# Altium project plobo_A2t.PrjPCB
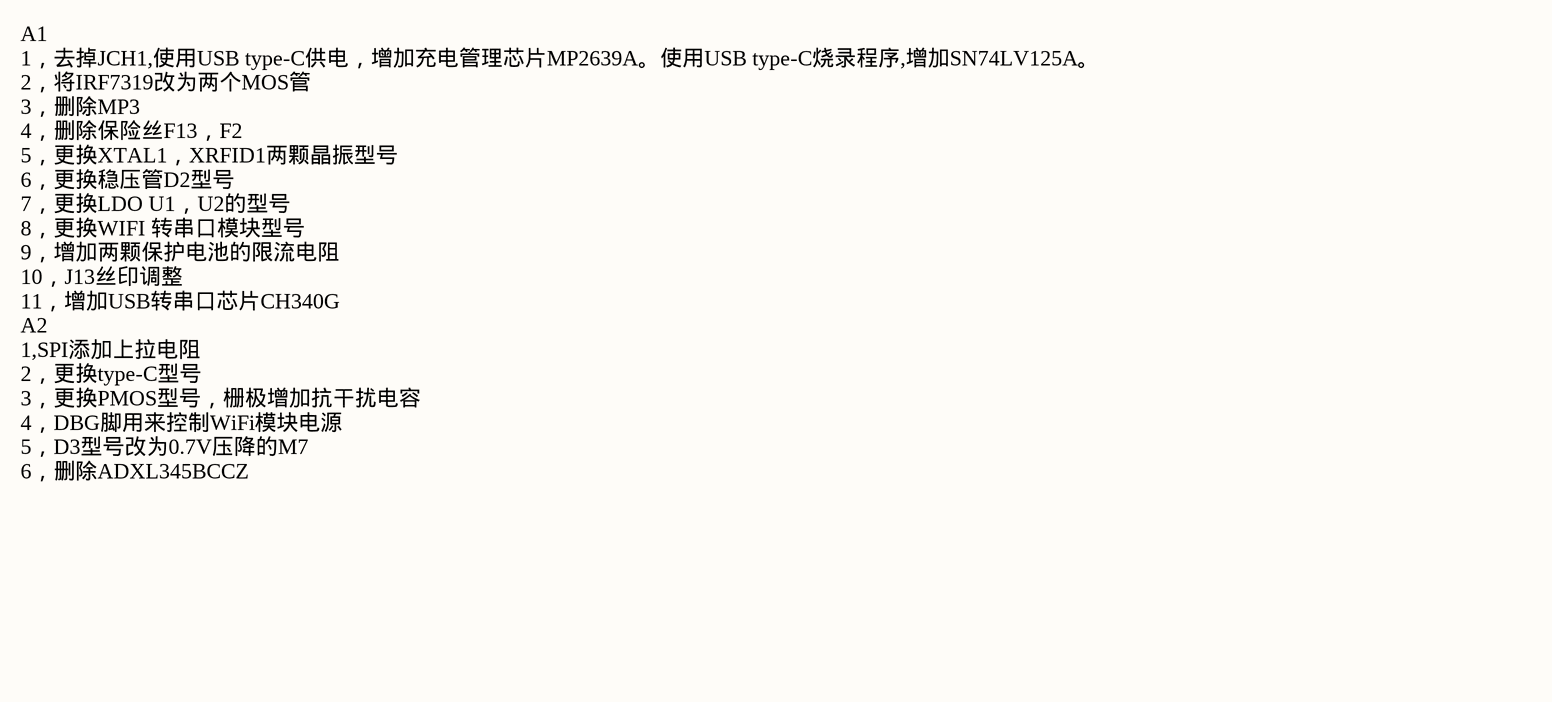
[diagram p0: changelist.SchDoc]
8 sheets, 200 parts. Net scope: global (net labels, ports and power ports of the same name join across sheets).
Board file: plobot_final23.PcbDoc
Sheets:
  changelist.SchDoc
  power.SchDoc
  connections.SchDoc
    U_cpu = cpu.SchDoc
    U_inout = inout.SchDoc
    U_rfid = rfid.SchDoc
    U_motion = motion.SchDoc
    U_audio = audio.SchDoc

## Sheet changelist.SchDoc
size A2

### Notes on the sheet
- A1
  1，去掉JCH1,使用USB type-C供电，增加充电管理芯片MP2639A。使用USB type-C烧录程序,增加SN74LV125A。
  2，将IRF7319改为两个MOS管
  3，删除MP3
  4，删除保险丝F13，F2
  5，更换XTAL1，XRFID1两颗晶振型号
  6，更换稳压管D2型号
  7，更换LDO U1，U2的型号
  8，更换WIFI 转串口模块型号
  9，增加两颗保护电池的限流电阻
  10，J13丝印调整
  11，增加USB转串口芯片CH340G
  A2
  1,SPI添加上拉电阻
  2，更换type-C型号
  3，更换PMOS型号，栅极增加抗干扰电容
  4，DBG脚用来控制WiFi模块电源
  5，D3型号改为0.7V压降的M7
  6，删除ADXL345BCCZ

## Sheet power.SchDoc
size A2
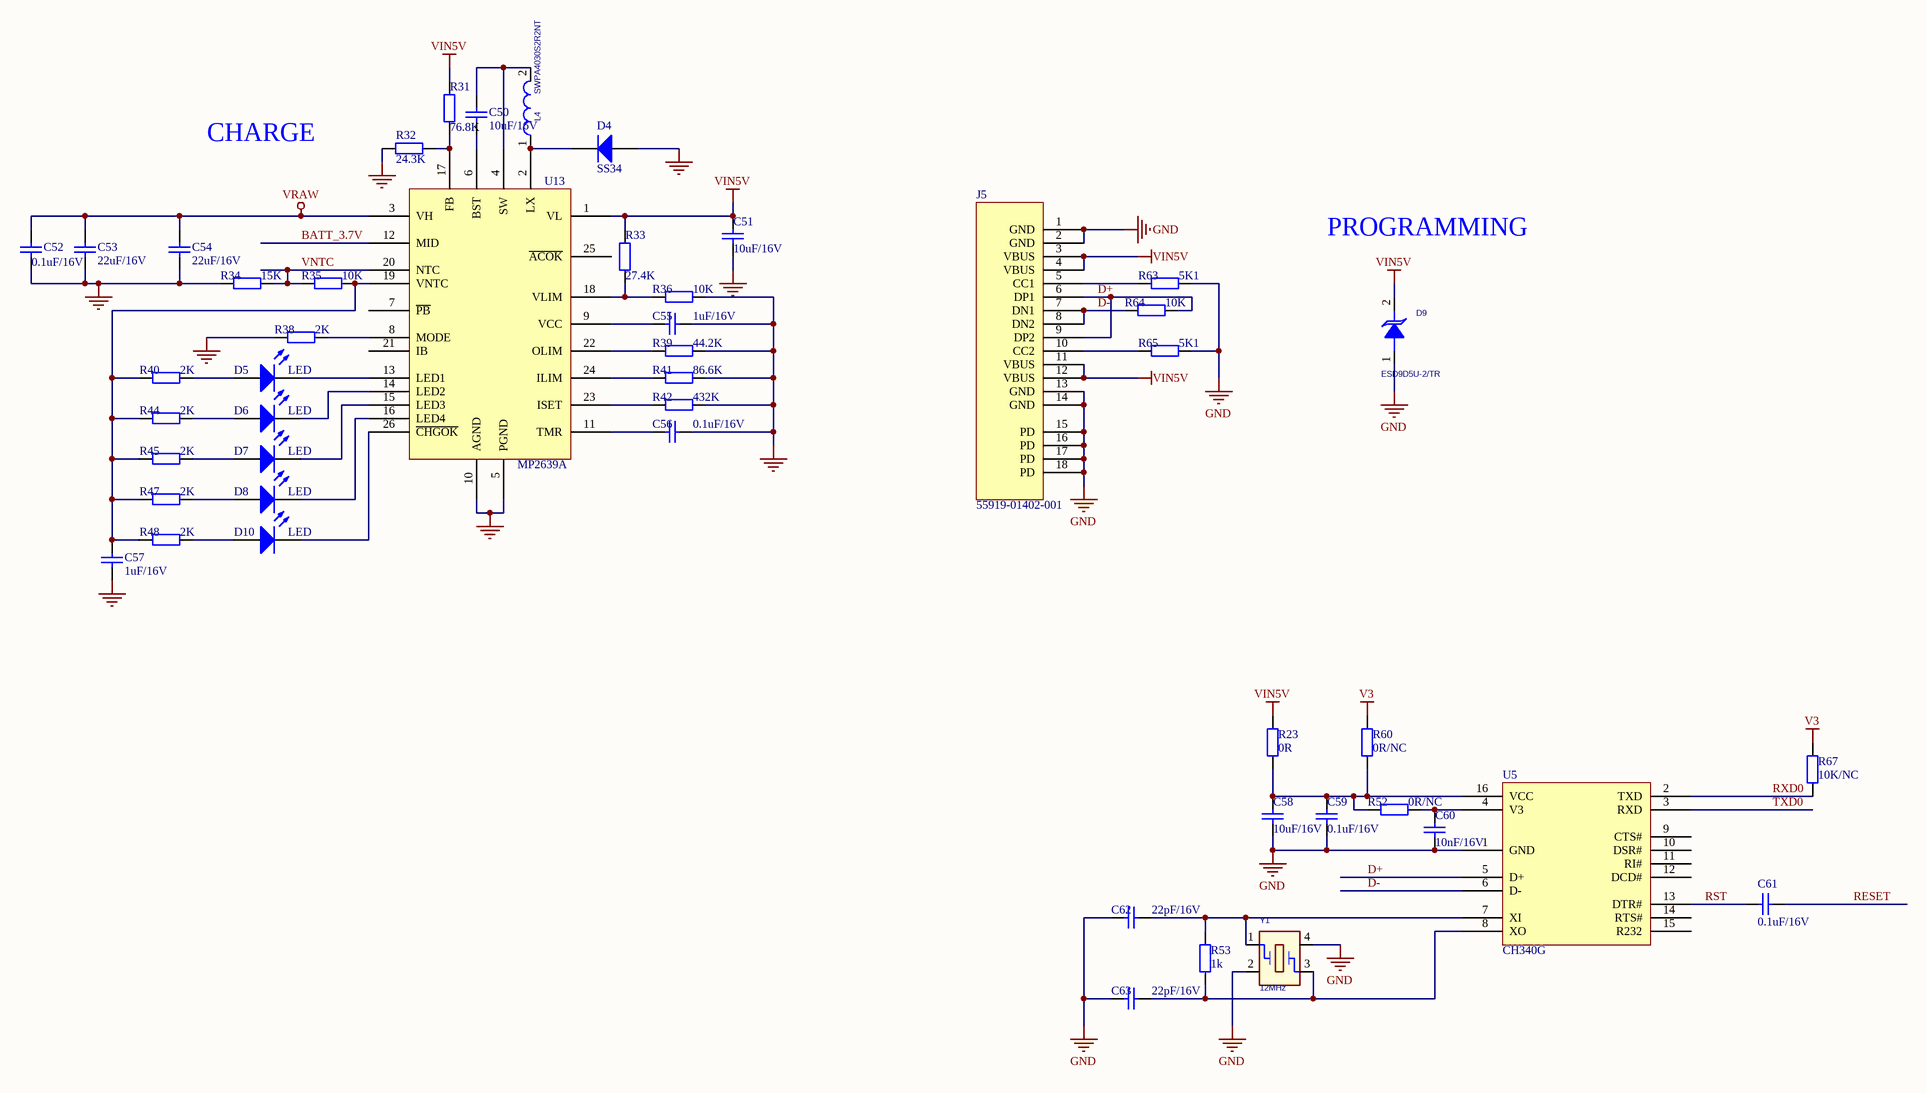
[diagram p1: power.SchDoc]

### Parts
C50  10uF/16V  [CAPC1608N]
C51  10uF/16V  [CAPC1608N]
C52  0.1uF/16V  [CAPC1608N]
C53  22uF/16V  [CAPC2012N]
C54  22uF/16V  [CAPC2012N]
C55  1uF/16V  [CAPC1608N]
C56  0.1uF/16V  [CAPC1608N]
C57  1uF/16V  [CAPC1608N]
C58  10uF/16V  [CAPC1608N]
C59  0.1uF/16V  [CAPC1608N]
C60  10nF/16V  [CAPC1608N]
C61  0.1uF/16V  [CAPC1608N]
C62  22pF/16V  [CAPC1608N]
C63  22pF/16V  [CAPC1608N]
D4  SS34  [SMB]
D5  LED  [0603LED G]
D6  LED  [0603LED G]
D7  LED  [0603LED G]
D8  LED  [0603LED G]
D9  ESD9D5U-2/TR  [sod-923]
D10  LED  [0603LED G]
J5  55919-01402-001  [55919-01402-001]
L4  SWPA4030S2R2NT  [L4X4]
R23  0R  [RESC1608N]
R31  76.8K  [RESC1608N]
R32  24.3K  [RESC1608N]
R33  27.4K  [RESC1608N]
R34  15K  [RESC1608N]
R35  10K  [RESC1608N]
R36  10K  [RESC1608N]
R38  2K  [RESC1608N]
R39  44.2K  [RESC1608N]
R40  2K  [RESC1608N]
R41  86.6K  [RESC1608N]
R42  432K  [RESC1608N]
R44  2K  [RESC1608N]
R45  2K  [RESC1608N]
R47  2K  [RESC1608N]
R48  2K  [RESC1608N]
R52  0R/NC  [RESC1608N]
R53  1k  [RESC1608N]
R60  0R/NC  [RESC1608N]
R63  5K1  [RESC1608N]
R64  10K  [RESC1608N]
R65  5K1  [RESC1608N]
R67  10K/NC  [RESC1608N]
U5  CH340G  [sop16]
U13  MP2639A  [MP2639A]
Y1  12MHz  [XTAL-3225]

### Nets
GND: C51.1 C52.1 C53.1 C54.1 C55.1 C56.1 C57.1 C58.2 C59.2 C60.2 C62.2 C63.2 D4.1(A) D9.1 J5.1(GND) J5.2(GND) J5.13(GND) J5.14(GND) J5.15(PD) J5.16(PD) J5.17(PD) J5.18(PD) R32.1 R34.2 R36.2 R38.2 R39.2 R41.2 R42.2 R63.1 R65.1 U5.1(GND) U13.5(PGND) U13.10(AGND) Y1.2 Y1.4
V3: R60.1 R67.1
VIN5V: C51.2 D9.2 J5.3(VBUS) J5.4(VBUS) J5.11(VBUS) J5.12(VBUS) R23.1 R31.1 R33.1 U13.1(VL)
VRAW: C52.2 C53.2 C54.2 U13.3(VH)
BATT_3.7V: U13.12(MID)
D+: J5.6(DP1) J5.9(DP2) R64.2 U5.5(D+)
D-: J5.7(DN1) J5.8(DN2) R64.1 U5.6(D-)
RESET: C61.2
RST: C61.1 U5.13(DTR#)
RXD0: R67.2 U5.2(TXD)
TXD0: U5.3(RXD)
VNTC: R34.1 R35.2 U13.20(NTC)
NetC50_1: C50.1 U13.6(BST)
NetC50_2: C50.2 L4.2 U13.4(SW)
NetC55_2: C55.2 U13.9(VCC)
NetC56_2: C56.2 U13.11(TMR)
NetC57_2: C57.2 R35.1 R40.2 R44.2 R45.2 R47.2 R48.2 U13.19(VNTC)
NetC58_1: C58.1 C59.1 R23.2 R52.2 R60.2 U5.16(VCC)
NetC60_1: C60.1 R52.1 U5.4(V3)
NetC62_1: C62.1 R53.1 U5.7(XI) Y1.1
NetC63_1: C63.1 R53.2 U5.8(XO) Y1.3
NetD4_2: D4.2(K) L4.1 U13.2(LX)
NetD5_1: D5.1(A) R40.1
NetD5_2: D5.2(K) U13.13(LED1)
NetD6_1: D6.1(A) R44.1
NetD6_2: D6.2(K) U13.14(LED2)
NetD7_1: D7.1(A) R45.1
NetD7_2: D7.2(K) U13.15(LED3)
NetD8_1: D8.1(A) R47.1
NetD8_2: D8.2(K) U13.16(LED4)
NetD10_1: D10.1(A) R48.1
NetD10_2: D10.2(K) U13.26(~{CHGOK})
NetJ5_5: J5.5(CC1) R63.2
NetJ5_10: J5.10(CC2) R65.2
NetR31_2: R31.2 R32.2 U13.17(FB)
NetR33_2: R33.2 R36.1 U13.18(VLIM)
NetR38_1: R38.1 U13.8(MODE)
NetR39_1: R39.1 U13.22(OLIM)
NetR41_1: R41.1 U13.24(ILIM)
NetR42_1: R42.1 U13.23(ISET)

Not connected (* = marked no-connect by the designer): U5 9(CTS#) 10(DSR#) 11(RI#) 12(DCD#) 14(RTS#) 15(R232); U13 7(~{PB}) 21(IB) 25(~{ACOK})

### Notes on the sheet
- CHARGE
- PROGRAMMING

### Library data of the parts
C50-C63 = Cap_2: Capacitor; PackageReference: RAD-0.3; ComponentLink2Description: Datasheet; ComponentLink3Description: DIGIKEY
  C50 C51 C58: Value: 10uF/16V
  C52 C56 C59 C61: Value: 0.1uF/16V
  C53 C54: Value: 22uF/16V
  C55 C57: Value: 1uF/16V
  C60: Value: 10nF/16V
  C62 C63: Value: 22pF/16V
D4 = DIODE: Default Diode; Published: 8-Jun-2000; LatestRevisionDate: 17-Jul-2002; LatestRevisionNote: Re-released for DXP Platform.; Publisher: Altium Limited; Code_JEDEC: DO-214-AB
D5-D8 D10 = LED0: Typical INFRARED GaAs LED; Published: 8-Jun-2000; LatestRevisionDate: 08-Jul-2005; LatestRevisionNote: Mech Layer 1 removed.; PackageReference: LED-0; Publisher: Altium Limited; PackageDescription: LED; 2 Leads
D9 = DIODE_TVS: DIODE TVS ESD PROT ULT LOW CAP 5-5.4V SOD-923; CLASS: IC; AGILE_PN: 480-77934; MFG_NAME01: ON SEMICONDUCTOR; MFG_PN01: ESD9L5.0ST5G; CAD_APPROVED: Yes; ROHS: Yes; HEIGHT: 0.40MM
L4 = IND_2.2uH_2.6A_10%_SMD: Inductor 2.2uH smt 2.6A, 58 milliohm; PartName: 2.2uH10%2.6Asmd; Mfr: TDK; MfrNum: VLCF5020T-2R2N2R6-3; TIIntPartnumber: 1L0025; Vendor: Digikey; Cost100: 1.11; Cost10K: 0.37
R23 R31-R36 R38-R42 R44 R45 R47 R48 R52 R53 R60 R63-R65 R67 = Res2: Resistor; PackageReference: AXIAL-0.4
  R23: Value: 0R; ComponentLink3Description: DIGIKEY
  R31: Value: 76.8K; ComponentLink3Description: DIGIKEY
  R32: Value: 24.3K; ComponentLink3Description: DIGIKEY
  R33: Value: 27.4K; ComponentLink3Description: DIGIKEY
  R34: Value: 15K; ComponentLink3Description: DIGIKEY
  R35 R36 R64: Value: 10K; ComponentLink3Description: DIGIKEY
  R38 R40 R44 R45 R47 R48: Value: 2K; ComponentLink3Description: DIGIKEY
  R39: Value: 44.2K; ComponentLink3Description: DIGIKEY
  R41: Value: 86.6K; ComponentLink3Description: DIGIKEY
  R42: Value: 432K; ComponentLink3Description: DIGIKEY
  R52 R60: Value: 0R/NC; ComponentLink3Description: DIGIKEY
  R53: Published: 8-Jun-2000; LatestRevisionDate: 17-Jul-2002; LatestRevisionNote: Re-released for DXP Platform.; Publisher: Altium Limited; Value: 1k
  R63 R65: Value: 5K1; ComponentLink3Description: DIGIKEY
  R67: Value: 10K/NC; ComponentLink3Description: DIGIKEY
Y1 = XTAL_13Y_A: CLASS: IC

## Sheet connections.SchDoc
size A4; PageSetup: Record=PageOptions|CenterHorizontal=False|CenterVertical=False|PrintScale=1.00|XCorrection=1.00|YCorrection=1.00|PrintKind=1|BorderSize=5000000|LeftOffset=0|BottomOffset=0|Orientation=2|PaperLength=1000|PaperWidth=1000|Scale=100|PaperSource=7|PrintQuality=-4|MediaType=1|DitherType=10|PaperKind=A4|PrintScaleMode=0
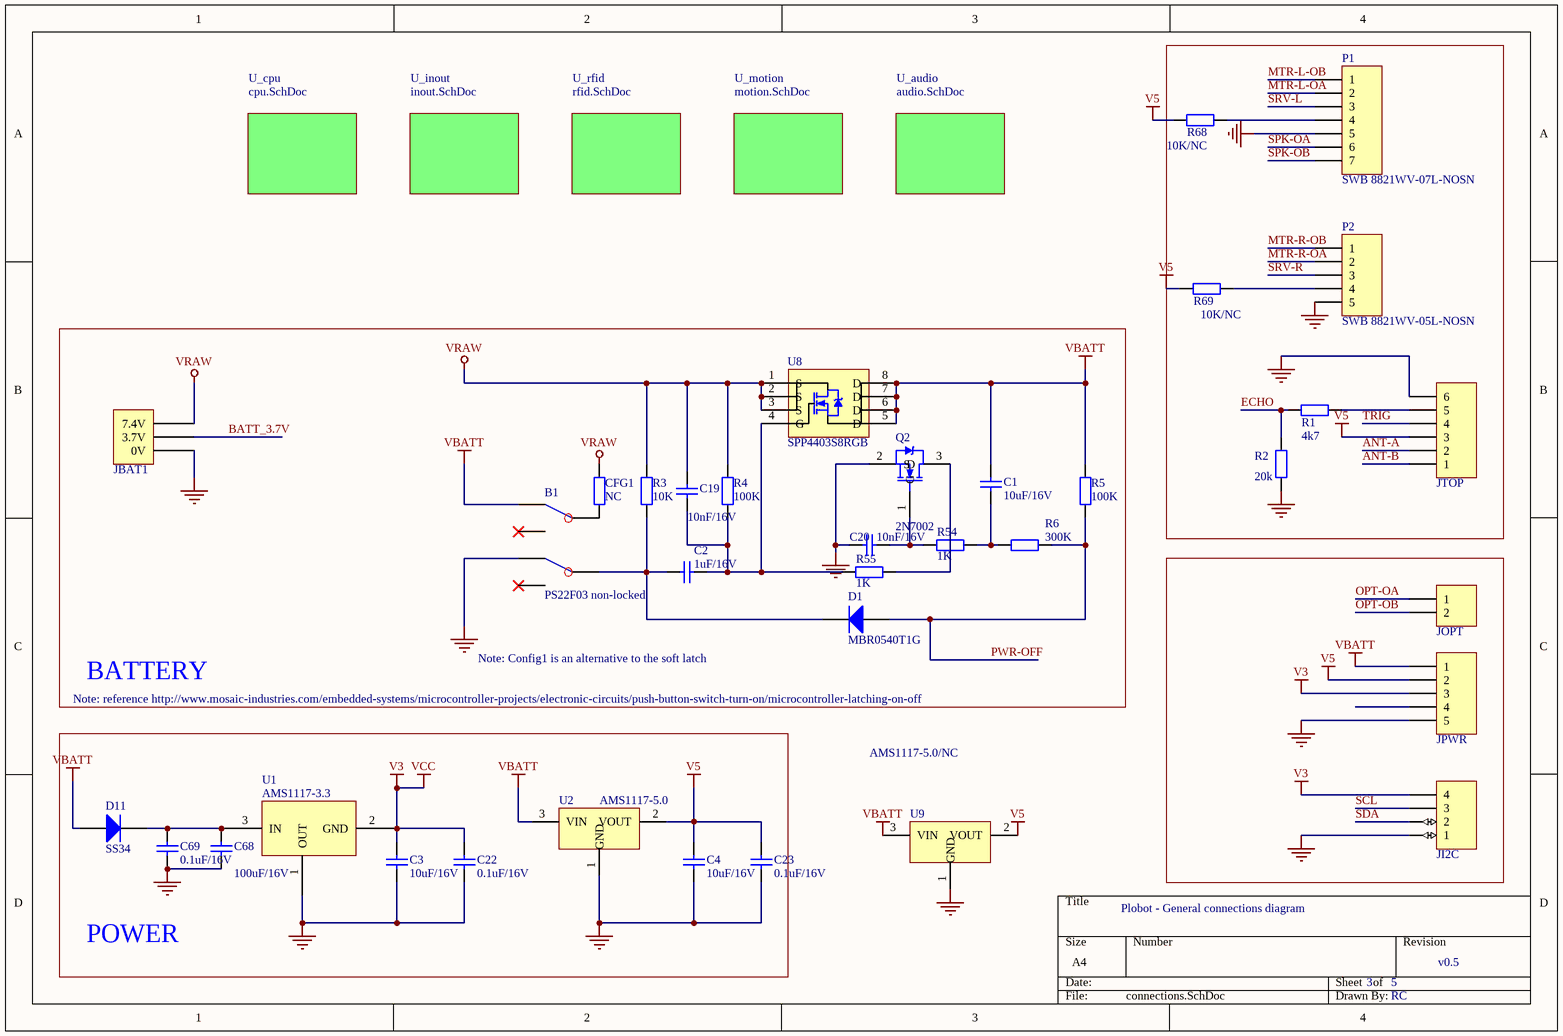
[diagram p2: connections.SchDoc]

### Parts
B1  PS22F03 non-locked  [KGPS22F03]
C1  10uF/16V  [CAPC1608N]
C2  1uF/16V  [CAPC1608N]
C3  10uF/16V  [CAPC1608N]
C4  10uF/16V  [CAPC1608N]
C19  10nF/16V  [CAPC1608N]
C20  10nF/16V  [CAPC1608N]
C22  0.1uF/16V  [CAPC1608N]
C23  0.1uF/16V  [CAPC1608N]
C68  100uF/16V  [Cap6.6X6.6]
C69  0.1uF/16V  [CAPC1608N]
CFG1  NC  [RESC1608N]
D1  MBR0540T1G  [SOD123/X.85]
D11  SS34  [SMB]
JBAT1  Charger  [S3B-XH-A(LF)(SN)]  (value not drawn)
JI2C  Header 4  [HDR1X4]  (value not drawn)
JOPT  Header 2  [HDR1X2]  (value not drawn)
JPWR  Component  [HDR1X5]  (value not drawn)
JTOP  w/lock  [JST-B6B-XH]  (value not drawn)
P1  SWB 8821WV-07L-NOSN  [XH2.54-7]
P2  SWB 8821WV-05L-NOSN  [XH2.54-5]
Q2  2N7002  [SOT23]
R1  4k7  [RESC1608N]
R2  20k  [RESC1608N]
R3  10K  [RESC1608N]
R4  100K  [RESC1608N]
R5  100K  [RESC1608N]
R6  300K  [RESC1608N]
R54  1K  [RESC1608N]
R55  1K  [RESC1608N]
R68  10K/NC  [RESC1608N]
R69  10K/NC  [RESC1608N]
U1  AMS1117-3.3  [SOT223]
U2  AMS1117-5.0  [TO252]
U8  SPP4403S8RGB  [SOP8]
U9  AMS1117-5.0/NC  [SOT-223]

### Blocks framed on the sheet
BATTERY: B1 C1 C2 C19 C20 CFG1 D1 JBAT1 Q2 R3-R6 R54 R55 U8
POWER: C3 C4 C22 C23 C68 C69 D11 U1 U2

### Sub-sheets
U_audio = audio.SchDoc: no entries
U_cpu = cpu.SchDoc: no entries
U_inout = inout.SchDoc: no entries
U_motion = motion.SchDoc: no entries
U_rfid = rfid.SchDoc: no entries

### Nets
GND: B1.4 C3.2 C4.1 C20.1 C22.1 C23.1 C68.1 C69.1 JBAT1.1(0V) JI2C.1 JPWR.5 JTOP.6 P1.5 P2.5 Q2.2(S) R2.2 U1.1(OUT) U2.1(GND) U9.1(GND)
V3: C3.1 C22.2 JI2C.4 JPWR.3 U1.2(GND)  [also labelled VCC]
V5: C4.2 C23.2 JPWR.2 JTOP.3 R68.1 R69.1 U2.2(VOUT) U9.2(VOUT)
VBATT: B1.3 C1.1 D11.1(A) JPWR.1 R5.2 U2.3(VIN) U8.5(D) U8.6(D) U8.7(D) U8.8(D) U9.3(VIN)
VRAW: C19.2 CFG1.1 JBAT1.3(7.4V) R3.2 R4.2 U8.1(S) U8.2(S) U8.3(S)
ANT-A: JTOP.2
ANT-B: JTOP.1
BATT_3.7V: JBAT1.2(3.7V)
ECHO: R1.1 R2.1
MTR-L-OA: P1.2
MTR-L-OB: P1.1
MTR-R-OA: P2.2
MTR-R-OB: P2.1
OPT-OA: JOPT.1
OPT-OB: JOPT.2
PWR-OFF: D1.2(A) R5.1 R6.1
SCL: JI2C.3
SDA: JI2C.2
SPK-OA: P1.6
SPK-OB: P1.7
SRV-L: P1.3
SRV-R: P2.3
TRIG: JTOP.4
NetB1_2: B1.2 CFG1.2
NetB1_5: B1.5 C2.1 D1.1(K) R3.1
NetC1_2: C1.2 R6.2 R54.1
NetC2_2: C2.2 C19.1 R4.1 R55.2 U8.4(G)
NetC20_2: C20.2 Q2.1(G) R54.2
NetC68_2: C68.2 C69.2 D11.2(K) U1.3(IN)
NetJTOP_5: JTOP.5 R1.2
NetP1_4: P1.4 R68.2
NetP2_4: P2.4 R69.2
NetQ2_3: Q2.3(D) R55.1

Not connected (* = marked no-connect by the designer): B1 1* 6*; JPWR 4

### Notes on the sheet
- Note: reference http://www.mosaic-industries.com/embedded-systems/microcontroller-projects/electronic-circuits/push-button-switch-turn-on/microcontroller-latching-on-off
- Note: Config1 is an alternative to the soft latch
- Plobot - General connections diagram
- 3
- 5
- v0.5
- RC

### Library data of the parts
B1 = Component_1
C1-C4 C19 C20 C22 C23 C69 = Cap_2: Capacitor; PackageReference: RAD-0.3
  C1: Value: 10uF/16V; ComponentLink2Description: Datasheet; ComponentLink3Description: DIGIKEY
  C2: Value: 1uF/16V; ComponentLink2Description: Datasheet; ComponentLink3Description: DIGIKEY
  C3: Published: 8-Jun-2000; LatestRevisionDate: 17-Jul-2002; LatestRevisionNote: Re-released for DXP Platform.; Publisher: Altium Limited; Value: 10uF/16V; PackageDescription: Radial Cap, Thru-Hole; 2 Leads; 0.3 in Pin Spacing
  C4: Published: 8-Jun-2000; LatestRevisionDate: 17-Jul-2002; LatestRevisionNote: Re-released for DXP Platform.; Publisher: Altium Limited; PackageDescription: Radial Cap, Thru-Hole; 2 Leads; 0.3 in Pin Spacing; Value: 10uF/16V
  C19 C20: Value: 10nF/16V; ComponentLink2Description: Datasheet; ComponentLink3Description: DIGIKEY
  C22 C23 C69: Value: 0.1uF/16V; ComponentLink2Description: Datasheet; ComponentLink3Description: DIGIKEY
C68 = Cap: Capacitor; Published: 8-Jun-2000; LatestRevisionDate: 17-Jul-2002; LatestRevisionNote: Re-released for DXP Platform.; PackageReference: RAD-0.3; Publisher: Altium Limited; PackageDescription: Radial Cap, Thru-Hole; 2 Leads; 0.3 in Pin Spacing; Value: 100uF/16V
CFG1 R1-R6 R54 R55 R68 R69 = Res2: Resistor; PackageReference: AXIAL-0.4
  CFG1: Value: NC; ComponentLink2Description: Datasheet; ComponentLink3Description: DIGIKEY
  R1: Published: 8-Jun-2000; LatestRevisionDate: 17-Jul-2002; LatestRevisionNote: Re-released for DXP Platform.; Publisher: Altium Limited; Value: 4k7
  R2: Published: 8-Jun-2000; LatestRevisionDate: 17-Jul-2002; LatestRevisionNote: Re-released for DXP Platform.; Publisher: Altium Limited; Value: 20k
  R3: Value: 10K; ComponentLink3Description: DIGIKEY
  R4 R5: Value: 100K; ComponentLink3Description: DIGIKEY
  R6: Value: 300K; ComponentLink3Description: DIGIKEY
  R54 R55: Value: 1K; ComponentLink3Description: DIGIKEY
  R68 R69: Published: 8-Jun-2000; LatestRevisionDate: 17-Jul-2002; LatestRevisionNote: Re-released for DXP Platform.; Publisher: Altium Limited; Value: 10K/NC
D1 = Diode: Default Diode; PackageReference: SMC; ComponentLink3Description: DIGIKEY; ComponentLink3URL: http://www.digikey.com/product-detail/en/fairchild-on-semiconductor/MBR0540/MBR0540TR-ND/1048787
D11 = Diode 1N4007: 1 Amp General Purpose Rectifier; Published: 8-Jun-2000; LatestRevisionDate: 17-Jul-2002; LatestRevisionNote: Re-released for DXP Platform.; DatasheetVersion: 1998; PackageVersion: Aug-1999; PackageReference: DO-41; Publisher: Altium Limited; PackageDescription: Diode, Axial; Body 5.2 x 2.7 mm (LxDia. max), Lead Dia. 0.86 mm (max); Code_JEDEC: DO-204-AL; ComponentLink1Description: Manufacturer Link; ComponentLink1URL: http://www.fairchildsemi.com/; ComponentLink2Description: Datasheet; ComponentLink2URL: http://www.fairchildsemi.com/ds/1N%2F1N4001.pdf
JBAT1 = BATTCON: ComponentLink3Description: TAOBAO; ComponentLink3URL: https://item.taobao.com/item.htm?spm=a1z09.2.0.0.HEqzjA&id=524112080121&_u=goqqgqg0b2c
JI2C = Header 4: Header, 4-Pin; ComponentLink3Description: DIGIKEY
JOPT = Header 2: Header, 2-Pin; LatestRevisionDate: 17-Jul-2002; LatestRevisionNote: Re-released for DXP Platform.; Publisher: Altium Limited
JPWR P2 = Header 5: Header, 5-Pin; LatestRevisionDate: 17-Jul-2002; LatestRevisionNote: Re-released for DXP Platform.; Publisher: Altium Limited
JTOP = Header 6: Header, 6-Pin; ComponentLink2Description: http://www.digikey.com/products/en?keywords=B6B-XH-A(LF)(SN); ComponentLink3Description: DIGIKEY
P1 = Header 7: Header, 7-Pin; LatestRevisionDate: 17-Jul-2002; LatestRevisionNote: Re-released for DXP Platform.; Publisher: Altium Limited
Q2 = 2N7002: NMOS
U1 = LM1117
U2 U9 = LM1117-3.3V

## Sheet cpu.SchDoc
size A4
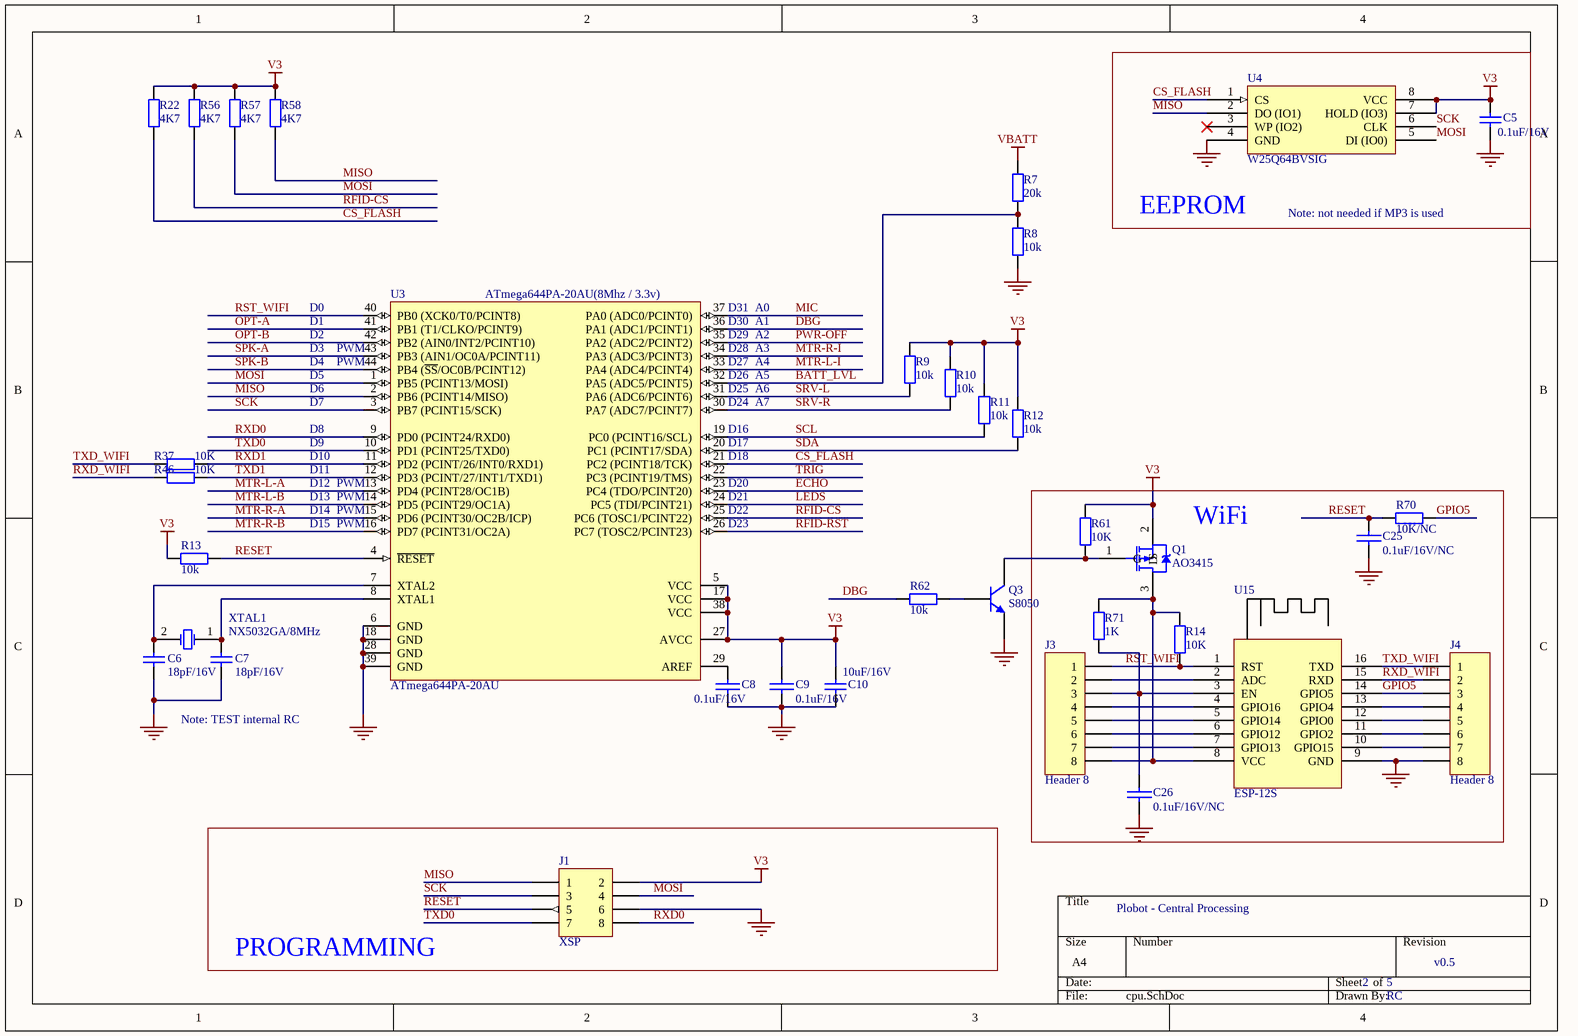
[diagram p3: cpu.SchDoc]

### Parts
C5  0.1uF/16V  [CAPC1608N]
C6  18pF/16V  [CAPC1608N]
C7  18pF/16V  [CAPC1608N]
C8  0.1uF/16V  [CAPC1608N]
C9  0.1uF/16V  [CAPC1608N]
C10  10uF/16V  [CAPC1608N]
C25  0.1uF/16V/NC  [CAPC1608N]
C26  0.1uF/16V/NC  [CAPC1608N]
J1  XSP  [HDR2X4]
J3  Header 8  [HDR1X8]
J4  Header 8  [HDR1X8]
Q1  AO3415  [SOT23]
Q3  S8050  [sot23]
R7  20k  [RESC1608N]
R8  10k  [RESC1608N]
R9  10k  [RESC1608N]
R10  10k  [RESC1608N]
R11  10k  [RESC1608N]
R12  10k  [RESC1608N]
R13  10k  [RESC1608N]
R14  10K  [RESC1608N]
R22  4K7  [RESC1608N]
R37  10K  [RESC1608N]
R46  10K  [RESC1608N]
R56  4K7  [RESC1608N]
R57  4K7  [RESC1608N]
R58  4K7  [RESC1608N]
R61  10K  [RESC1608N]
R62  10k  [RESC1608N]
R70  10K/NC  [RESC1608N]
R71  1K  [RESC1608N]
U3  ATmega644PA-20AU  [atmega644p]
U4  W25Q64BVSIG  [W25Q64BVSIG]
U15  ESP-12S  [ESP-12S]
XTAL1  NX5032GA/8MHz  [XTAL]

### Blocks framed on the sheet
EEPROM: C5 U4
WiFi: C25 C26 J3 J4 Q1 R14 R61 R70 R71 U15
PROGRAMMING: J1

### Nets
GND: C5.2 C6.1 C7.1 C8.2 C9.2 C10.1 C25.2 C26.2 J1.6 J4.8 Q3.1(E) R8.1 U3.6(GND) U3.18(GND) U3.28(GND) U3.39(GND) U4.4(GND) U15.9(GND)
V3: C5.1 C9.1 C10.2 J1.2 Q1.2(S) R9.1 R10.1 R11.2 R12.1 R13.1 R22.1 R56.1 R57.1 R58.1 R61.1 U3.5(VCC) U3.17(VCC) U3.27(AVCC) U3.38(VCC) U4.7(HOLD_(IO3)) U4.8(VCC)
VBATT: R7.2
BATT_LVL: R7.1 R8.2 U3.32(PA5_(ADC5/PCINT5))
CS_FLASH: R22.2 U3.21(PC2_(PCINT18/TCK)) U4.1(CS)
DBG: R62.1 U3.36(PA1_(ADC1/PCINT1))
ECHO: U3.23(PC4_(TDO/PCINT20))
GPIO5: J4.3 R70.2 U15.14(GPIO5)
LEDS: U3.24(PC5_(TDI/PCINT21))
MIC: U3.37(PA0_(ADC0/PCINT0))
MISO: J1.1 R58.2 U3.2(PB6_(PCINT14/MISO)) U4.2(DO_(IO1))
MOSI: J1.4 R57.2 U3.1(PB5_(PCINT13/MOSI)) U4.5(DI_(IO0))
MTR-L-A: U3.13(PD4_(PCINT28/OC1B))
MTR-L-B: U3.14(PD5_(PCINT29/OC1A))
MTR-L-I: U3.33(PA4_(ADC4/PCINT4))
MTR-R-A: U3.15(PD6_(PCINT30/OC2B/ICP))
MTR-R-B: U3.16(PD7_(PCINT31/OC2A))
MTR-R-I: U3.34(PA3_(ADC3/PCINT3))
OPT-A: U3.41(PB1_(T1/CLKO/PCINT9))
OPT-B: U3.42(PB2_(AIN0/INT2/PCINT10))
PWR-OFF: U3.35(PA2_(ADC2/PCINT2))
RESET: C25.1 J1.5 R13.2 R70.1 U3.4(~{RESET})
RFID-CS: R56.2 U3.25(PC6_(TOSC1/PCINT22))
RFID-RST: U3.26(PC7_(TOSC2/PCINT23))
RST_WIFI: J3.1 R14.1 U3.40(PB0_(XCK0/T0/PCINT8)) U15.1(RST)
RXD0: J1.8 U3.9(PD0_(PCINT24/RXD0))
RXD1: R37.2 U3.11(PD2_(PCINT/26/INT0/RXD1))
RXD_WIFI: J4.2 R46.1 U15.15(RXD)
SCK: J1.3 U3.3(PB7_(PCINT15/SCK)) U4.6(CLK)
SCL: R11.1 U3.19(PC0_(PCINT16/SCL))
SDA: R12.2 U3.20(PC1_(PCINT17/SDA))
SPK-A: U3.43(PB3_(AIN1/OC0A/PCINT11))
SPK-B: U3.44(PB4_(~{SS}/OC0B/PCINT12))
SRV-L: R9.2 U3.31(PA6_(ADC6/PCINT6))
SRV-R: R10.2 U3.30(PA7_(ADC7/PCINT7))
TRIG: U3.22(PC3_(PCINT19/TMS))
TXD0: J1.7 U3.10(PD1_(PCINT25/TXD0))
TXD1: R46.2 U3.12(PD3_(PCINT/27/INT1/TXD1))
TXD_WIFI: J4.1 R37.1 U15.16(TXD)
NetC6_2: C6.2 U3.7(XTAL2) XTAL1.2(OSC2)
NetC7_2: C7.2 U3.8(XTAL1) XTAL1.1(OSC1)
NetC8_1: C8.1 U3.29(AREF)
NetC26_1: C26.1 J3.3 R71.1 U15.3(EN)
NetJ3_2: J3.2 U15.2(ADC)
NetJ3_4: J3.4 U15.4(GPIO16)
NetJ3_5: J3.5 U15.5(GPIO14)
NetJ3_6: J3.6 U15.6(GPIO12)
NetJ3_7: J3.7 U15.7(GPIO13)
NetJ3_8: J3.8 Q1.3(D) R14.2 R71.2 U15.8(VCC)
NetJ4_4: J4.4 U15.13(GPIO4)
NetJ4_5: J4.5 U15.12(GPIO0)
NetJ4_6: J4.6 U15.11(GPIO2)
NetJ4_7: J4.7 U15.10(GPIO15)
NetQ1_1: Q1.1(G) Q3.3(C) R61.2
NetQ3_2: Q3.2(B) R62.2

Not connected (* = marked no-connect by the designer): U4 3(WP_(IO2))*

### Notes on the sheet
- Note: not needed if MP3 is used
- D0
- (near U3) ATmega644PA-20AU(8Mhz / 3.3v)
- (near U3) D31
- A0
- D1
- D2
- D3
- D4
- D5
- (near U3) PWM
- (near U3) D26
- (near U3) D27
- (near U3) D28
- (near U3) D29
- (near U3) D30
- A1
- A2
- A3
- A4
- A5
- D6
- D7
- D8
- D9
- (near U3) D16
- (near U3) D17
- (near U3) D24
- (near U3) D25
- A6
- A7
- D10
- D11
- D12
- D13
- D14
- (near U3) D18
- (near U3) D20
- (near U3) D21
- (near U3) D22
- D15
- (near U3) D23
- Note: TEST internal RC
- Plobot - Central Processing
- 2
- 5
- v0.5
- RC

### Library data of the parts
C5-C9 C25 C26 = Cap: Capacitor
  C5: Published: 8-Jun-2000; LatestRevisionDate: 17-Jul-2002; LatestRevisionNote: Re-released for DXP Platform.; PackageReference: RAD-0.3; Publisher: Altium Limited; PackageDescription: Radial Cap, Thru-Hole; 2 Leads; 0.3 in Pin Spacing; Value: 0.1uF/16V
  C6 C7: Published: 8-Jun-2000; LatestRevisionDate: 17-Jul-2002; LatestRevisionNote: Re-released for DXP Platform.; PackageReference: RAD-0.3; Publisher: Altium Limited; Value: 18pF/16V
C10 = Cap_2: Capacitor; Published: 8-Jun-2000; LatestRevisionDate: 17-Jul-2002; LatestRevisionNote: Re-released for DXP Platform.; PackageReference: RAD-0.3; Publisher: Altium Limited; PackageDescription: Radial Cap, Thru-Hole; 2 Leads; 0.3 in Pin Spacing; Value: 10uF/16V
J1 = Header 4X2H: Header, 4-Pin, Dual row, Right Angle; LatestRevisionDate: 17-Jul-2002; LatestRevisionNote: Re-released for DXP Platform.; Publisher: Altium Limited
J3 J4 = Header 8: Header, 8-Pin; LatestRevisionDate: 17-Jul-2002; LatestRevisionNote: Re-released for DXP Platform.; Publisher: Altium Limited
Q1 = AO3415: PMOS
Q3 = 2N3904: NPN General Purpose Amplifier; Published: 8-Jun-2000; LatestRevisionDate: 15-Jan-2003; LatestRevisionNote: PCB Footprint 'BCY-W3/D4.7' replaced; DatasheetVersion: 1997; PackageVersion: Sep-1998; PackageReference: TO-92A; Publisher: Altium Limited; PackageDescription: TO, Flat Index; 3 In-Line, Axial Leads; Body Dia. 4.5mm; Leads 0.51 x 0.48 mm (max); ComponentLink1Description: Manufacturer Link; ComponentLink1URL: http://www.fairchildsemi.com/; ComponentLink2Description: Datasheet; ComponentLink2URL: http://www.fairchildsemi.com/ds/2N%2F2N3904.pdf
R7-R14 R22 R37 R46 R56-R58 R61 R62 R70 R71 = Res2: Resistor; Published: 8-Jun-2000; LatestRevisionDate: 17-Jul-2002; LatestRevisionNote: Re-released for DXP Platform.; PackageReference: AXIAL-0.4; Publisher: Altium Limited
  R7: Value: 20k
  R8-R13 R62: Value: 10k
  R14 R37 R46 R61: Value: 10K
  R22 R56-R58: Value: 4K7
  R70: Value: 10K/NC
  R71: Value: 1K
U3 = ATmega644-20AU: 8-bit AVR Microcontroller, 2.7-5.5V, 20MHz, 64KB Flash, 2KB EEPROM, 4KB SRAM, 44-pin TQFP; DatasheetVersion: revN, Jul-2010; PackageVersion: revC, Oct-2010; PackageReference: 44A; PackageDescription: 44-Pin Plastic Thin Profile Quad Flat Pack, 10 x 10 x 1.0 mm Body, 0.8 mm Pitch (TQFP); Code_JEDEC: MS-026-ACB; ComponentLink1Description: Manufacturer URL; ComponentLink1URL: http://www.atmel.com/; ComponentLink2Description: ATmega644 Datasheet; ComponentLink2URL: http://www.atmel.com/dyn/resources/prod_documents/doc2593.pdf; ComponentLink3Description: ATmega644 Summary; ComponentLink3URL: http://www.atmel.com/dyn/resources/prod_documents/2593S.pdf
XTAL1 = ABM7-8.000MHZ-D2Y-T

## Sheet inout.SchDoc
size A4
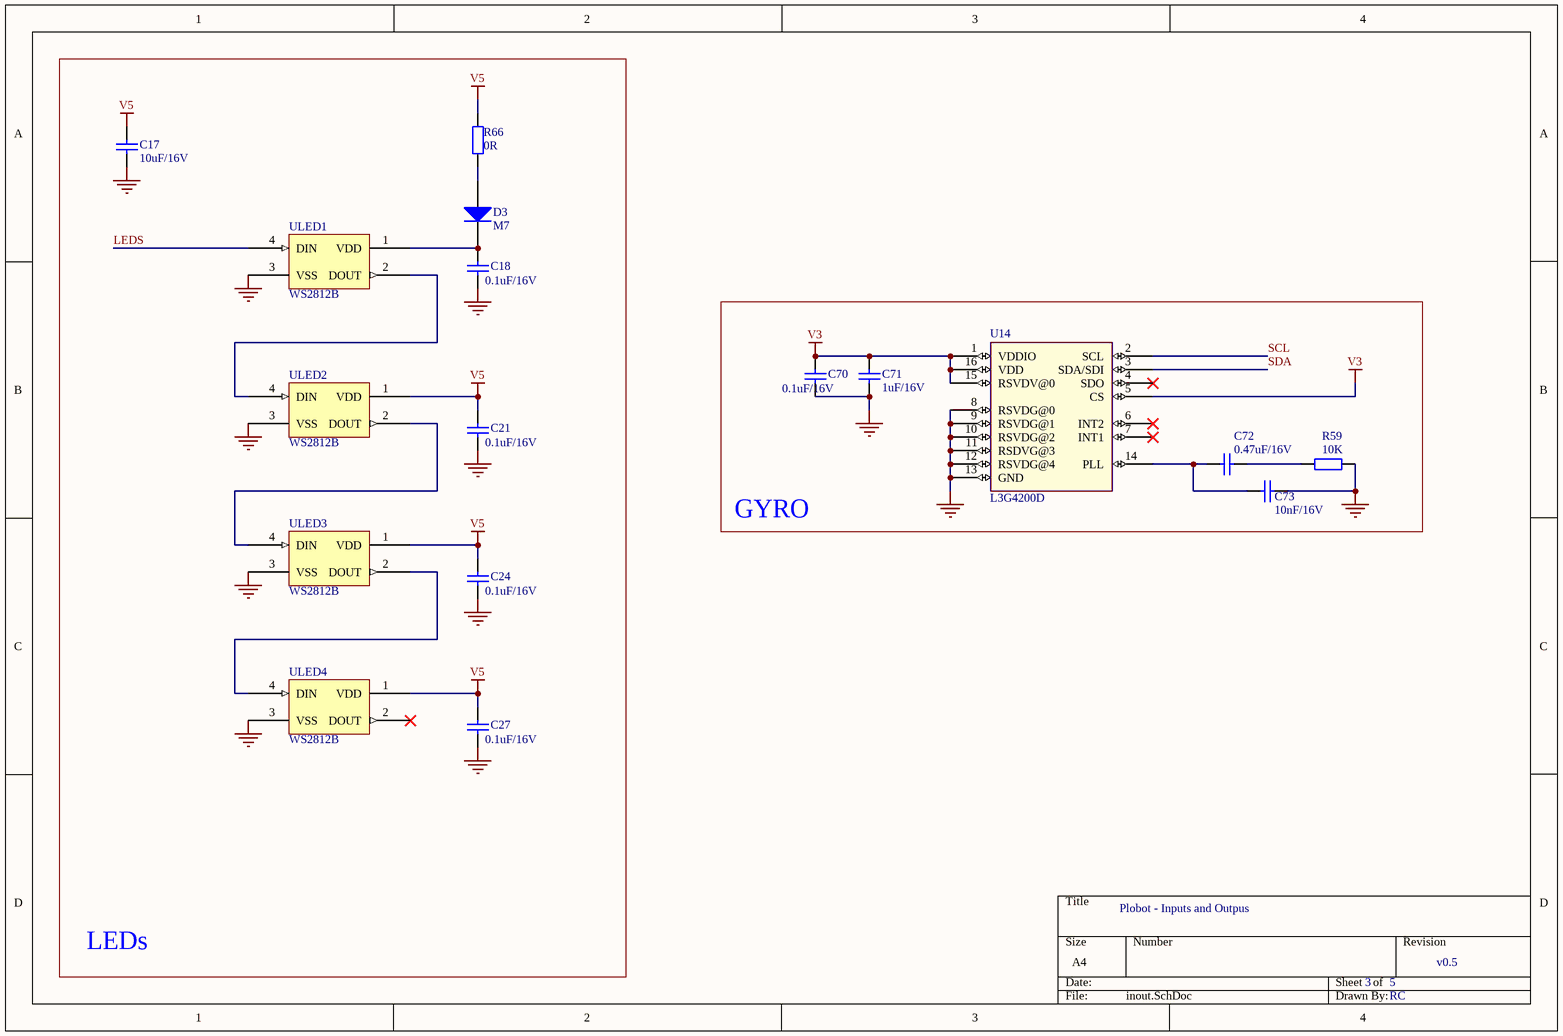
[diagram p4: inout.SchDoc]

### Parts
C17  10uF/16V  [CAPC1608N]
C18  0.1uF/16V  [CAPC1608N]
C21  0.1uF/16V  [CAPC1608N]
C24  0.1uF/16V  [CAPC1608N]
C27  0.1uF/16V  [CAPC1608N]
C70  0.1uF/16V  [CAPC1608N]
C71  1uF/16V  [CAPC1608N]
C72  0.47uF/16V  [CAPC1608N]
C73  10nF/16V  [CAPC1608N]
D3  M7  [SMA]
R59  10K  [RESC1608N]
R66  0R  [RESC1608N]
U14  L3G4200D  [LGA16-4X4]
ULED1  WS2812B  [WS2812B]
ULED2  WS2812B  [WS2812B]
ULED3  WS2812B  [WS2812B]
ULED4  WS2812B  [WS2812B]

### Blocks framed on the sheet
LEDs: C17 C18 C21 C24 C27 D3 R66 ULED1-ULED4
GYRO: C70-C73 R59 U14

### Nets
GND: C17.2 C18.2 C21.2 C24.2 C27.2 C70.2 C71.2 C73.2 R59.2 U14.8(RSVDG@0) U14.9(RSVDG@1) U14.10(RSVDG@2) U14.11(RSDVG@3) U14.12(RSVDG@4) U14.13(GND) ULED1.3(VSS) ULED2.3(VSS) ULED3.3(VSS) ULED4.3(VSS)
V3: C70.1 C71.1 U14.1(VDDIO) U14.5(CS) U14.15(RSVDV@0) U14.16(VDD)
V5: C17.1 C21.1 C24.1 C27.1 R66.2 ULED2.1(VDD) ULED3.1(VDD) ULED4.1(VDD)
LEDS: ULED1.4(DIN)
SCL: U14.2(SCL)
SDA: U14.3(SDA/SDI)
NetC18_1: C18.1 D3.2(K) ULED1.1(VDD)
NetC72_1: C72.1 C73.1 U14.14(PLL)
NetC72_2: C72.2 R59.1
NetD3_1: D3.1(A) R66.1
NetULED1_2: ULED1.2(DOUT) ULED2.4(DIN)
NetULED2_2: ULED2.2(DOUT) ULED3.4(DIN)
NetULED3_2: ULED3.2(DOUT) ULED4.4(DIN)

Not connected (* = marked no-connect by the designer): U14 4(SDO)* 6(INT2)* 7(INT1)*; ULED4 2(DOUT)*

### Notes on the sheet
- Plobot - Inputs and Outpus
- 3
- 5
- v0.5
- RC

### Library data of the parts
C17 C71-C73 = Cap_2: Capacitor; PackageReference: RAD-0.3
  C17: Published: 8-Jun-2000; LatestRevisionDate: 17-Jul-2002; LatestRevisionNote: Re-released for DXP Platform.; Publisher: Altium Limited; PackageDescription: Radial Cap, Thru-Hole; 2 Leads; 0.3 in Pin Spacing; Value: 10uF/16V
  C71: Value: 1uF/16V; ComponentLink3Description: DIGIKEY
  C72: Value: 0.47uF/16V; ComponentLink3Description: DIGIKEY
  C73: Value: 10nF/16V; ComponentLink3Description: DIGIKEY
C18 C21 C24 C27 C70 = Cap: Capacitor; PackageReference: RAD-0.3; Value: 0.1uF/16V
  C18 C21 C24 C27: Published: 8-Jun-2000; LatestRevisionDate: 17-Jul-2002; LatestRevisionNote: Re-released for DXP Platform.; Publisher: Altium Limited; PackageDescription: Radial Cap, Thru-Hole; 2 Leads; 0.3 in Pin Spacing
  C70: ComponentLink3Description: DIGIKEY
D3 = Diode: Default Diode; Published: 8-Jun-2000; LatestRevisionDate: 17-Jul-2002; LatestRevisionNote: Re-released for DXP Platform.; PackageVersion: Sep-1996; PackageReference: SMC; Publisher: Altium Limited; PackageDescription: DO-214-AB/SMC; 2 C-Bend Leads; Body 7.9 x 5.9 mm, inc. leads (LxW); Code_JEDEC: DO-214-AB
R59 R66 = Res2: Resistor; PackageReference: AXIAL-0.4
  R59: Value: 10K; ComponentLink3Description: DIGIKEY
  R66: Published: 8-Jun-2000; LatestRevisionDate: 17-Jul-2002; LatestRevisionNote: Re-released for DXP Platform.; Publisher: Altium Limited; Value: 0R
U14 = L3G4200D: L3G4200D Series 2.4 - 3.6 V Three-axis Angular Rate MEMS Motion Sensor - LGA-16; Price: 1.5 USD; Value: *; ComponentLink3Description: DIGIKEY; ComponentLink3URL: http://www.digikey.com/product-detail/en/stmicroelectronics/L3G4200DTR/497-11071-6-ND/2587913

## Sheet rfid.SchDoc
size A4
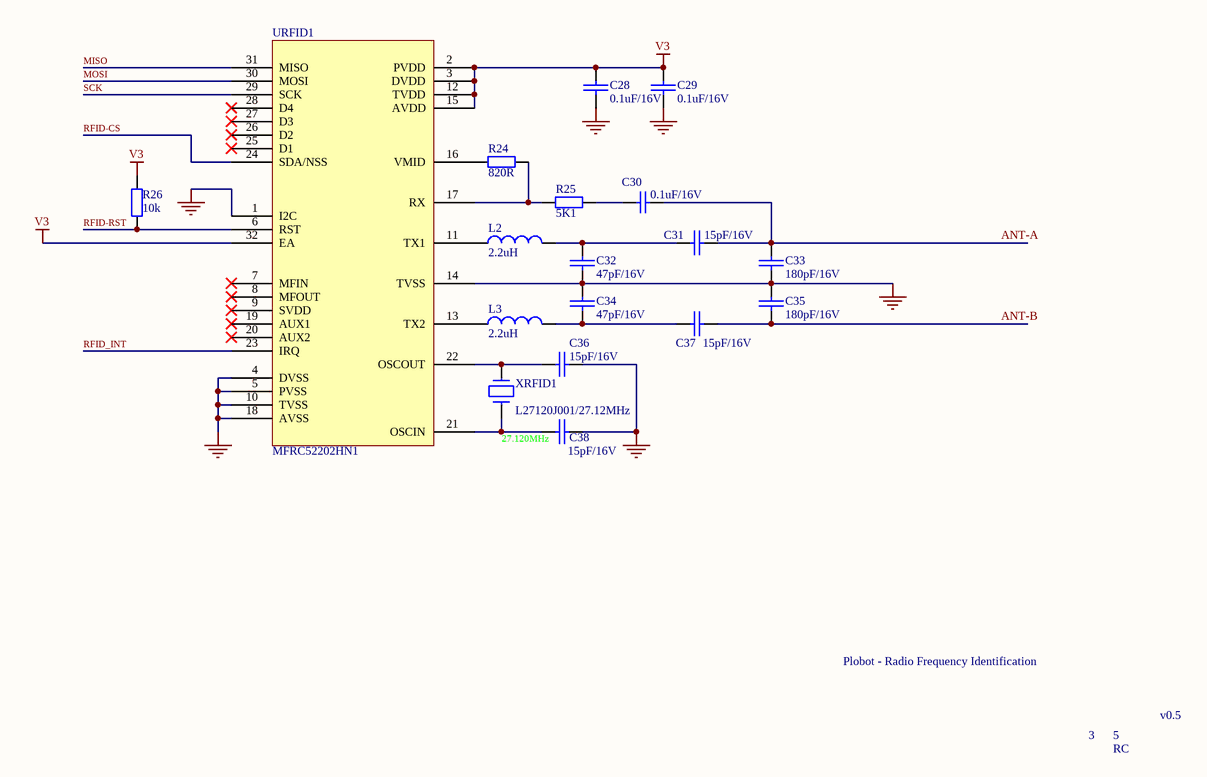
[diagram p5: rfid.SchDoc]

### Parts
C28  0.1uF/16V  [CAPC1608N]
C29  0.1uF/16V  [CAPC1608N]
C30  0.1uF/16V  [CAPC1608N]
C31  15pF/16V  [CAPC1608N]
C32  47pF/16V  [CAPC1608N]
C33  180pF/16V  [CAPC1608N]
C34  47pF/16V  [CAPC1608N]
C35  180pF/16V  [CAPC1608N]
C36  15pF/16V  [CAPC1608N]
C37  15pF/16V  [CAPC1608N]
C38  15pF/16V  [CAPC1608N]
L2  2.2uH  [INDC1608N]
L3  2.2uH  [INDC1608N]
R24  820R  [RESC1608N]
R25  5K1  [RESC1608N]
R26  10k  [RESC1608N]
URFID1  MFRC52202HN1  [MFRC52202HN1]
XRFID1  L27120J001/27.12MHz  [XTAL]

### Nets
GND: C28.1 C29.1 C32.1 C33.1 C34.2 C35.2 C36.2 C38.2 URFID1.1(I2C) URFID1.4(DVSS) URFID1.5(PVSS) URFID1.10(TVSS) URFID1.14(TVSS) URFID1.18(AVSS)
V3: C28.2 C29.2 R26.1 URFID1.2(PVDD) URFID1.3(DVDD) URFID1.12(TVDD) URFID1.15(AVDD) URFID1.32(EA)
ANT-A: C30.2 C31.2 C33.2
ANT-B: C35.1 C37.2
MISO: URFID1.31(MISO)
MOSI: URFID1.30(MOSI)
RFID-CS: URFID1.24(SDA/NSS)
RFID-RST: R26.2 URFID1.6(RST)
RFID_INT: URFID1.23(IRQ)
SCK: URFID1.29(SCK)
NetC30_1: C30.1 R25.1
NetC31_1: C31.1 C32.2 L2.2
NetC34_1: C34.1 C37.1 L3.2
NetC36_1: C36.1 URFID1.22(OSCOUT) XRFID1.2
NetC38_1: C38.1 URFID1.21(OSCIN) XRFID1.1
NetL2_1: L2.1 URFID1.11(TX1)
NetL3_1: L3.1 URFID1.13(TX2)
NetR24_1: R24.1 R25.2 URFID1.17(RX)
NetR24_2: R24.2 URFID1.16(VMID)

Not connected (* = marked no-connect by the designer): URFID1 7(MFIN)* 8(MFOUT)* 9(SVDD)* 19(AUX1)* 20(AUX2)* 25(D1)* 26(D2)* 27(D3)* 28(D4)*

### Notes on the sheet
- (near C38) 27.120MHz
- Plobot - Radio Frequency Identification
- 3
- 5
- v0.5
- RC

### Library data of the parts
C28-C38 = Cap: Capacitor
  C30: Published: 8-Jun-2000; LatestRevisionDate: 17-Jul-2002; LatestRevisionNote: Re-released for DXP Platform.; PackageReference: RAD-0.3; Publisher: Altium Limited; PackageDescription: Radial Cap, Thru-Hole; 2 Leads; 0.3 in Pin Spacing; Value: 0.1uF/16V
L2 L3 = Inductor: Code_IEC: 1005; Published: 8-Jun-2000; LatestRevisionDate: 29-May-2009; LatestRevisionNote: IPC-7351 Footprint Added.; PackageReference: 0402-A; Publisher: Altium Limited; PackageDescription: Chip Inductor; Code_JEITA: 0402; Value: 2.2uH
R24-R26 = Res2: Resistor; Published: 8-Jun-2000; LatestRevisionDate: 17-Jul-2002; LatestRevisionNote: Re-released for DXP Platform.; PackageReference: AXIAL-0.4; Publisher: Altium Limited
  R24: Value: 820R
  R25: Value: 5K1
  R26: Value: 10k
XRFID1 = Tm08B.S01_12M_42

## Sheet motion.SchDoc
size A4
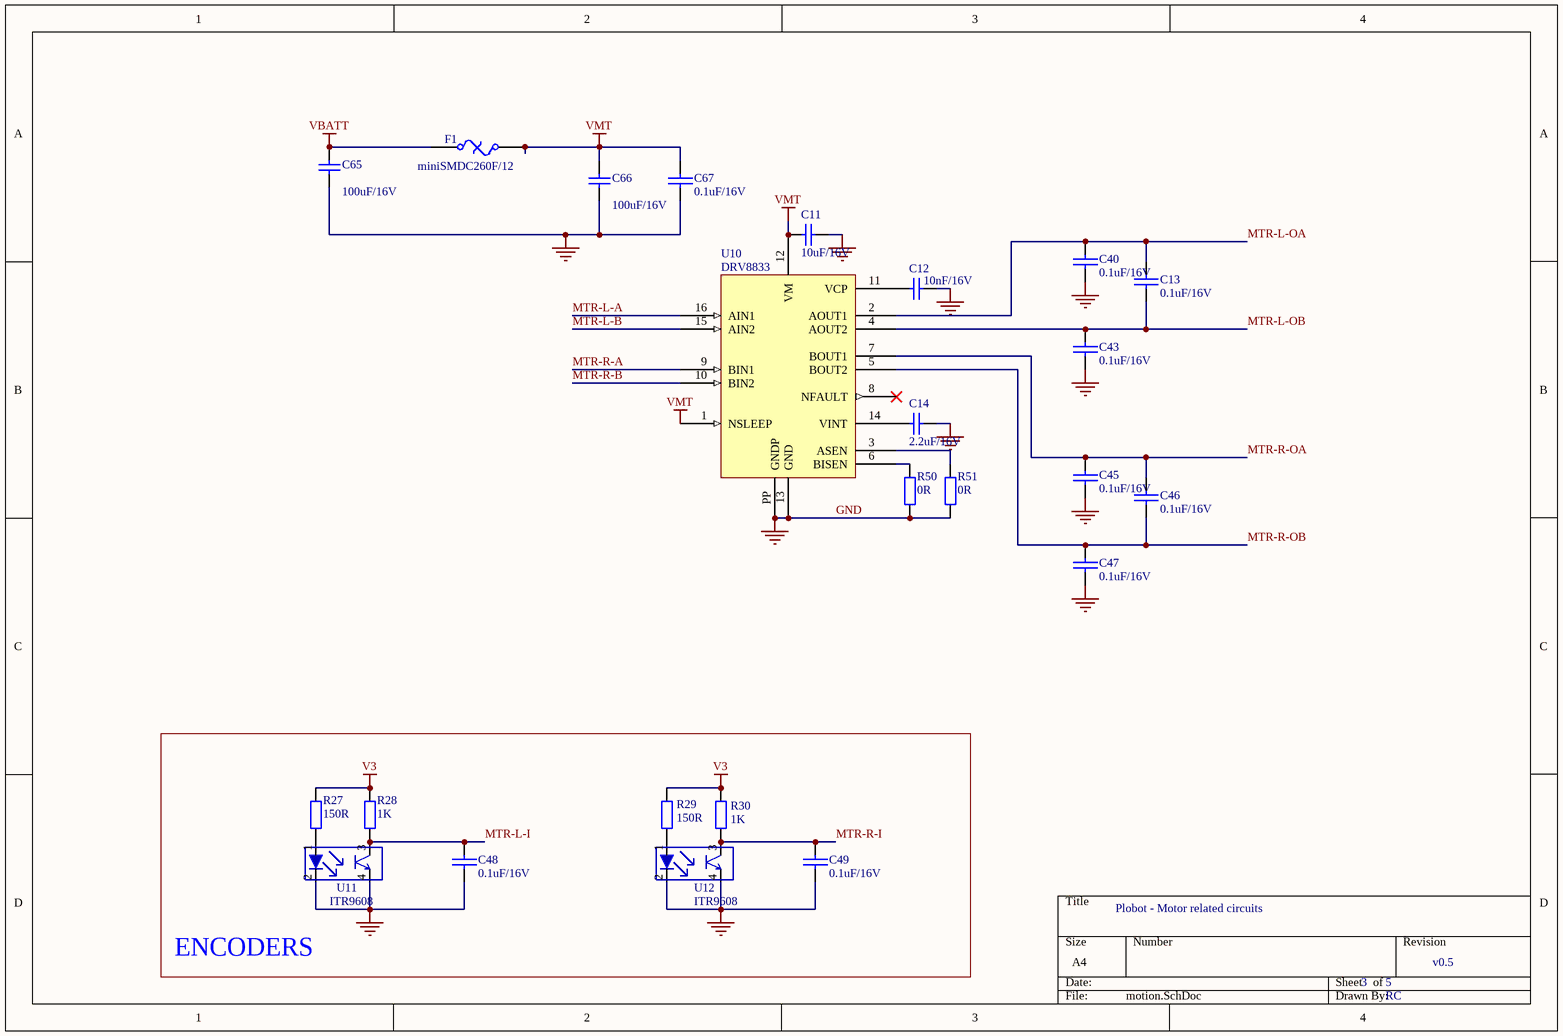
[diagram p6: motion.SchDoc]

### Parts
C11  10uF/16V  [CAPC1608N]
C12  10nF/16V  [CAPC1608N]
C13  0.1uF/16V  [CAPC1608N]
C14  2.2uF/16V  [CAPC1608N]
C40  0.1uF/16V  [CAPC1608N]
C43  0.1uF/16V  [CAPC1608N]
C45  0.1uF/16V  [CAPC1608N]
C46  0.1uF/16V  [CAPC1608N]
C47  0.1uF/16V  [CAPC1608N]
C48  0.1uF/16V  [CAPC1608N]
C49  0.1uF/16V  [CAPC1608N]
C65  100uF/16V  [Cap6.6X6.6]
C66  100uF/16V  [Cap6.6X6.6]
C67  0.1uF/16V  [CAPC1608N]
F1  miniSMDC260F/12  [miniSMDC260F/12]
R27  150R  [RESC1608N]
R28  1K  [RESC1608N]
R29  150R  [RESC1608N]
R30  1K  [RESC1608N]
R50  0R  [RESC1608N]
R51  0R  [RESC1608N]
U10  DRV8833  [DRV8833]
U11  ITR9608  [ITR9608]
U12  ITR9608  [ITR9608]

### Blocks framed on the sheet
ENCODERS: C48 C49 R27-R30 U11 U12

### Nets
GND: C11.1 C12.1 C14.1 C40.1 C43.1 C45.1 C47.1 C48.1 C49.1 C65.1 C66.1 C67.1 R50.1 R51.1 U10.13(GND) U10.PP(GNDP) U11.2(CATHODE) U11.4(ENITIER) U12.2(CATHODE) U12.4(ENITIER)
V3: R27.2 R28.2 R29.2 R30.2
VBATT: C65.2 F1.1
VMT: C11.2 C66.2 C67.2 F1.2 U10.1(NSLEEP) U10.12(VM)
MTR-L-A: U10.16(AIN1)
MTR-L-B: U10.15(AIN2)
MTR-L-I: C48.2 R28.1 U11.3(COLLECTOR)
MTR-L-OA: C13.2 C40.2 U10.2(AOUT1)
MTR-L-OB: C13.1 C43.2 U10.4(AOUT2)
MTR-R-A: U10.9(BIN1)
MTR-R-B: U10.10(BIN2)
MTR-R-I: C49.2 R30.1 U12.3(COLLECTOR)
MTR-R-OA: C45.2 C46.2 U10.7(BOUT1)
MTR-R-OB: C46.1 C47.2 U10.5(BOUT2)
NetC12_2: C12.2 U10.11(VCP)
NetC14_2: C14.2 U10.14(VINT)
NetR27_1: R27.1 U11.1(ANODE)
NetR29_1: R29.1 U12.1(ANODE)
NetR50_2: R50.2 U10.6(BISEN)
NetR51_2: R51.2 U10.3(ASEN)

Not connected (* = marked no-connect by the designer): U10 8(NFAULT)*

### Notes on the sheet
- Plobot - Motor related circuits
- 3
- 5
- v0.5
- RC

### Library data of the parts
C11 = Cap_2: Capacitor; Published: 8-Jun-2000; LatestRevisionDate: 17-Jul-2002; LatestRevisionNote: Re-released for DXP Platform.; PackageReference: RAD-0.3; Publisher: Altium Limited; PackageDescription: Radial Cap, Thru-Hole; 2 Leads; 0.3 in Pin Spacing; Value: 10uF/16V
C12-C14 C40 C43 C45-C49 C65-C67 = Cap: Capacitor
  C12: Published: 8-Jun-2000; LatestRevisionDate: 17-Jul-2002; LatestRevisionNote: Re-released for DXP Platform.; PackageReference: RAD-0.3; Publisher: Altium Limited; PackageDescription: Radial Cap, Thru-Hole; 2 Leads; 0.3 in Pin Spacing; Value: 10nF/16V
  C14: Published: 8-Jun-2000; LatestRevisionDate: 17-Jul-2002; LatestRevisionNote: Re-released for DXP Platform.; PackageReference: RAD-0.3; Publisher: Altium Limited; PackageDescription: Radial Cap, Thru-Hole; 2 Leads; 0.3 in Pin Spacing; Value: 2.2uF/16V
  C65 C66: Published: 8-Jun-2000; LatestRevisionDate: 17-Jul-2002; LatestRevisionNote: Re-released for DXP Platform.; PackageReference: RAD-0.3; Publisher: Altium Limited; PackageDescription: Radial Cap, Thru-Hole; 2 Leads; 0.3 in Pin Spacing; Value: 100uF/16V
F1 = Fuse Thermal: Thermal Fuse; Published: 24-Mar-1999; LatestRevisionDate: 17-Jul-2002; LatestRevisionNote: Re-released for DXP Platform.; PackageReference: PIN-W2/E2.8; Publisher: Altium Limited
R27-R30 R50 R51 = Res2: Resistor; Published: 8-Jun-2000; LatestRevisionDate: 17-Jul-2002; LatestRevisionNote: Re-released for DXP Platform.; PackageReference: AXIAL-0.4; Publisher: Altium Limited
  R27 R29: Value: 150R
  R28 R30: Value: 1K
  R50 R51: Value: 0R

## Sheet audio.SchDoc
size A4
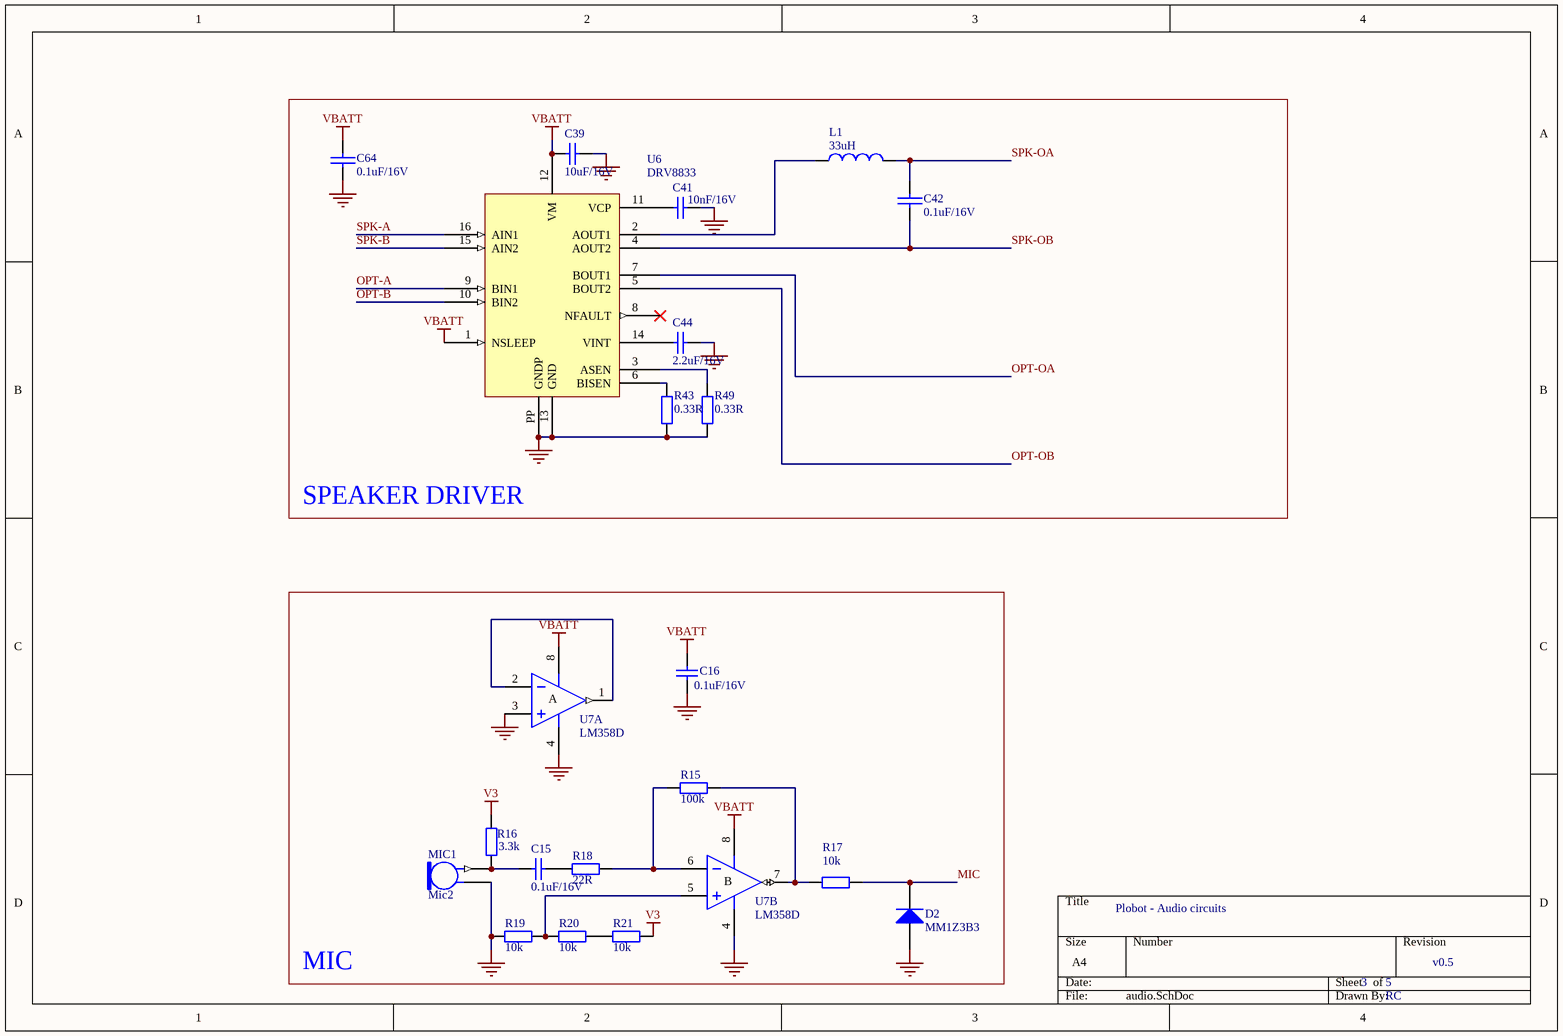
[diagram p7: audio.SchDoc]

### Parts
C15  0.1uF/16V  [CAPC1608N]
C16  0.1uF/16V  [CAPC1608N]
C39  10uF/16V  [CAPC1608N]
C41  10nF/16V  [CAPC1608N]
C42  0.1uF/16V  [CAPC1608N]
C44  2.2uF/16V  [CAPC1608N]
C64  0.1uF/16V  [CAPC1608N]
D2  MM1Z3B3  [SOD123/X.85]
L1  33uH  [INDC1608N]
MIC1  Mic2  [electret_6mm]
R15  100k  [RESC1608N]
R16  3.3k  [RESC1608N]
R17  10k  [RESC1608N]
R18  22R  [RESC1608N]
R19  10k  [RESC1608N]
R20  10k  [RESC1608N]
R21  10k  [RESC1608N]
R43  0.33R  [RESC1608N]
R49  0.33R  [RESC1608N]
U6  DRV8833  [DRV8833]
U7  LM358D  [LM358D]  (parts A,B of 2)

### Blocks framed on the sheet
SPEAKER DRIVER: C39 C41 C42 C44 C64 L1 R43 R49 U6
MIC: C15 C16 D2 MIC1 R15-R21 U7

### Nets
GND: C16.2 C39.1 C41.1 C44.1 C64.1 D2.2(A) MIC1.2 R19.1 R43.1 R49.1 U6.13(GND) U6.PP(GNDP) U7.3(IN+) U7.4(V-)
V3: R16.1 R21.2
VBATT: C16.1 C39.2 C64.2 U6.1(NSLEEP) U6.12(VM) U7.8(V+)
MIC: D2.1(K) R17.2
OPT-A: U6.9(BIN1)
OPT-B: U6.10(BIN2)
OPT-OA: U6.7(BOUT1)
OPT-OB: U6.5(BOUT2)
SPK-A: U6.16(AIN1)
SPK-B: U6.15(AIN2)
SPK-OA: C42.2 L1.2
SPK-OB: C42.1 U6.4(AOUT2)
NetC15_1: C15.1 R18.1
NetC15_2: C15.2 MIC1.1 R16.2
NetC41_2: C41.2 U6.11(VCP)
NetC44_2: C44.2 U6.14(VINT)
NetL1_1: L1.1 U6.2(AOUT1)
NetR15_1: R15.1 R18.2 U7.6(IN-)
NetR15_2: R15.2 R17.1 U7.7(OUT)
NetR19_2: R19.2 R20.1 U7.5(IN+)
NetR20_2: R20.2 R21.1
NetR43_2: R43.2 U6.6(BISEN)
NetR49_2: R49.2 U6.3(ASEN)
NetU7_1: U7.1(OUT) U7.2(IN-)

Not connected (* = marked no-connect by the designer): U6 8(NFAULT)*

### Notes on the sheet
- Plobot - Audio circuits
- 3
- 5
- v0.5
- RC
- (in symbol LM358D, part A) A
- (in symbol LM358D, part B) B

### Library data of the parts
C15 C16 C41 C42 C44 C64 = Cap: Capacitor
  C15 C16: Published: 8-Jun-2000; LatestRevisionDate: 17-Jul-2002; LatestRevisionNote: Re-released for DXP Platform.; PackageReference: RAD-0.3; Publisher: Altium Limited; PackageDescription: Radial Cap, Thru-Hole; 2 Leads; 0.3 in Pin Spacing; Value: 0.1uF/16V
  C41: Published: 8-Jun-2000; LatestRevisionDate: 17-Jul-2002; LatestRevisionNote: Re-released for DXP Platform.; PackageReference: RAD-0.3; Publisher: Altium Limited; PackageDescription: Radial Cap, Thru-Hole; 2 Leads; 0.3 in Pin Spacing; Value: 10nF/16V
  C44: Published: 8-Jun-2000; LatestRevisionDate: 17-Jul-2002; LatestRevisionNote: Re-released for DXP Platform.; PackageReference: RAD-0.3; Publisher: Altium Limited; PackageDescription: Radial Cap, Thru-Hole; 2 Leads; 0.3 in Pin Spacing; Value: 2.2uF/16V
C39 = Cap_2: Capacitor; Published: 8-Jun-2000; LatestRevisionDate: 17-Jul-2002; LatestRevisionNote: Re-released for DXP Platform.; PackageReference: RAD-0.3; Publisher: Altium Limited; PackageDescription: Radial Cap, Thru-Hole; 2 Leads; 0.3 in Pin Spacing; Value: 10uF/16V
D2 = Diode: Default Diode; Published: 8-Jun-2000; LatestRevisionDate: 17-Jul-2002; LatestRevisionNote: Re-released for DXP Platform.; PackageVersion: Sep-1996; PackageReference: SMC; Publisher: Altium Limited; Code_JEDEC: DO-214-AB
L1 = Inductor: Code_IEC: 1005; Published: 8-Jun-2000; LatestRevisionDate: 29-May-2009; LatestRevisionNote: IPC-7351 Footprint Added.; PackageReference: 0402-A; Publisher: Altium Limited; PackageDescription: Chip Inductor; Code_JEITA: 0402; Value: 33uH
MIC1 = Mic2: Microphone; value: KUF4323; Published: *; LatestRevisionDate: *; LatestRevisionNote: *; PackageReference: *; Publisher: *
R15-R21 R43 R49 = Res2: Resistor; Published: 8-Jun-2000; LatestRevisionDate: 17-Jul-2002; LatestRevisionNote: Re-released for DXP Platform.; PackageReference: AXIAL-0.4; Publisher: Altium Limited
  R15: Value: 100k
  R16: Value: 3.3k
  R17 R19-R21: Value: 10k
  R18: Value: 22R
  R43 R49: Value: 0.33R
U7 = LM358D: Dual Operational Amplifier; Published: 16-Jan-2001; LatestRevisionDate: 13-Apr-2006; LatestRevisionNote: IPC-7351 Footprint Added.; DatasheetVersion: Jul-1998; PackageVersion: Jan-1998; PackageReference: D008; Publisher: Altium Limited; PackageDescription: 8-Pin Small Outline Integrated Circuit 1.27 mm Pitch; Code_IPC: SOIC127P600-8; ComponentLink1Description: Manufacturer Link; ComponentLink1URL: http://www.ti.com/; ComponentLink2Description: Datasheet; ComponentLink2URL: http://www-s.ti.com/sc/ds/lm358.pdf

## Nets that join several sheets
GND: power (36 pins), connections (19 pins), cpu (18 pins), inout (19 pins), rfid (14 pins), motion (20 pins), audio (14 pins)
V3: power (R60.1 R67.1), connections (5 pins), cpu (21 pins), inout (6 pins), rfid (8 pins), motion (R27.2 R28.2 R29.2 R30.2), audio (R16.1 R21.2)
V5: connections (8 pins), inout (8 pins)
VBATT: connections (11 pins), cpu (R7.2), motion (C65.2 F1.1), audio (6 pins)
VRAW: power (C52.2 C53.2 C54.2 U13.3), connections (8 pins)
ANT-A: connections (JTOP.2), rfid (C30.2 C31.2 C33.2)
ANT-B: connections (JTOP.1), rfid (C35.1 C37.2)
BATT_3.7V: power (U13.12), connections (JBAT1.2)
ECHO: connections (R1.1 R2.1), cpu (U3.23)
LEDS: cpu (U3.24), inout (ULED1.4)
MIC: cpu (U3.37), audio (D2.1 R17.2)
MISO: cpu (J1.1 R58.2 U3.2 U4.2), rfid (URFID1.31)
MOSI: cpu (J1.4 R57.2 U3.1 U4.5), rfid (URFID1.30)
MTR-L-A: cpu (U3.13), motion (U10.16)
MTR-L-B: cpu (U3.14), motion (U10.15)
MTR-L-I: cpu (U3.33), motion (C48.2 R28.1 U11.3)
MTR-L-OA: connections (P1.2), motion (C13.2 C40.2 U10.2)
MTR-L-OB: connections (P1.1), motion (C13.1 C43.2 U10.4)
MTR-R-A: cpu (U3.15), motion (U10.9)
MTR-R-B: cpu (U3.16), motion (U10.10)
MTR-R-I: cpu (U3.34), motion (C49.2 R30.1 U12.3)
MTR-R-OA: connections (P2.2), motion (C45.2 C46.2 U10.7)
MTR-R-OB: connections (P2.1), motion (C46.1 C47.2 U10.5)
OPT-A: cpu (U3.41), audio (U6.9)
OPT-B: cpu (U3.42), audio (U6.10)
OPT-OA: connections (JOPT.1), audio (U6.7)
OPT-OB: connections (JOPT.2), audio (U6.5)
PWR-OFF: connections (D1.2 R5.1 R6.1), cpu (U3.35)
RESET: power (C61.2), cpu (5 pins)
RFID-CS: cpu (R56.2 U3.25), rfid (URFID1.24)
RFID-RST: cpu (U3.26), rfid (R26.2 URFID1.6)
RXD0: power (R67.2 U5.2), cpu (J1.8 U3.9)
SCK: cpu (J1.3 U3.3 U4.6), rfid (URFID1.29)
SCL: connections (JI2C.3), cpu (R11.1 U3.19), inout (U14.2)
SDA: connections (JI2C.2), cpu (R12.2 U3.20), inout (U14.3)
SPK-A: cpu (U3.43), audio (U6.16)
SPK-B: cpu (U3.44), audio (U6.15)
SPK-OA: connections (P1.6), audio (C42.2 L1.2)
SPK-OB: connections (P1.7), audio (C42.1 U6.4)
SRV-L: connections (P1.3), cpu (R9.2 U3.31)
SRV-R: connections (P2.3), cpu (R10.2 U3.30)
TRIG: connections (JTOP.4), cpu (U3.22)
TXD0: power (U5.3), cpu (J1.7 U3.10)